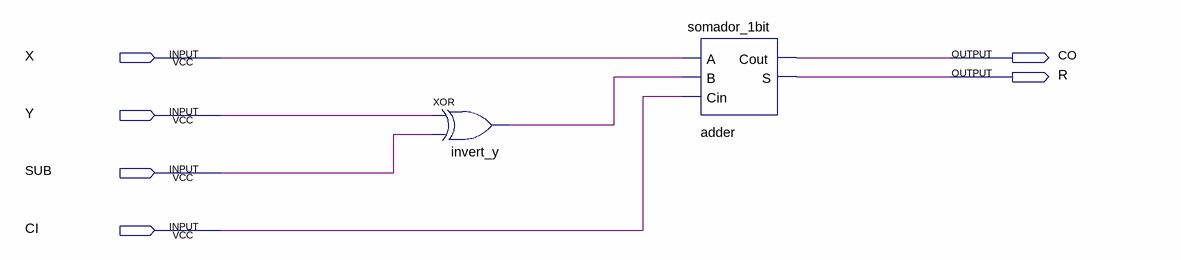
[diagram p0: schematic sheet]
// Quartus schematic ADD_SUB_BIT.bdf as structural Verilog: 2 symbols, 6 pins
module ADD_SUB_BIT (
  input  X,
  input  Y,
  input  SUB,
  input  CI,
  output CO,
  output R
);

  wire invert_y_out;

  xor invert_y (invert_y_out, Y, SUB);
  somador_1bit adder (.A(X), .B(invert_y_out), .Cin(CI), .Cout(CO), .S(R));
endmodule
